# Altium schematic sheet GLCD.SchDoc
size A4
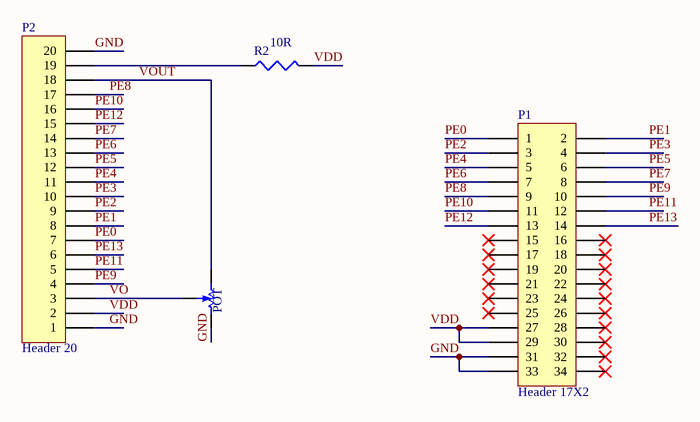
[diagram p0: GLCD.SchDoc]

## Parts
P1  Header 17X2  [HDR2X17]
P2  Header 20  [small_header]
POT  RPot SM  [pot]  (value not drawn)
R2  value 10R  [1206]  (hidden comment: Res3)

## Nets
GND: P1.31 P1.33 P2.1 P2.20 POT.CW(+)
PE0: P1.1 P2.7
PE1: P1.2 P2.8
PE2: P1.3 P2.9
PE3: P1.4 P2.10
PE4: P1.5 P2.11
PE5: P1.6 P2.12
PE6: P1.7 P2.13
PE7: P1.8 P2.14
PE8: P1.9 P2.17
PE9: P1.10 P2.4
PE10: P1.11 P2.16
PE11: P1.12 P2.5
PE12: P1.13 P2.15
PE13: P1.14 P2.6
VDD: P1.27 P1.29 P2.2 R2.2
VO: P2.3 POT.W
VOUT: P2.18 POT.CCW(-)
NetP2_19: P2.19 R2.1

Not connected (* = marked no-connect by the designer): P1 15* 16* 17* 18* 19* 20* 21* 22* 23* 24* 25* 26* 28* 30* 32* 34*

## Library data of the parts
P1 = Header 17X2: Header, 17-Pin, Dual row; LatestRevisionDate: 17-Jul-2002; LatestRevisionNote: Re-released for DXP Platform.; Publisher: Altium Limited
P2 = Header 20: Header, 20-Pin; LatestRevisionDate: 17-Jul-2002; LatestRevisionNote: Re-released for DXP Platform.; Publisher: Altium Limited
POT = RPot SM: Square Trimming Potentiometer; Published: 17-Dec-2003; DatasheetVersion: Oct-2003; PackageReference: POT4MM-2; Publisher: Altium Limited; PackageDescription: Square Trimming Potentiometer; ComponentLink1Description: Manufacturer Link; ComponentLink1URL: http://bourns.com/2/search.html
R2 = Res3: Resistor; Published: 8-Jun-2000; LatestRevisionDate: 29-May-2009; LatestRevisionNote: IPC-7351 Footprint Added.; PackageReference: J1-0603; Publisher: Altium Limited; PackageDescription: Chip Resistor